# EAGLE design E-P-020-R2.0 (EAGLE 7.3.0)
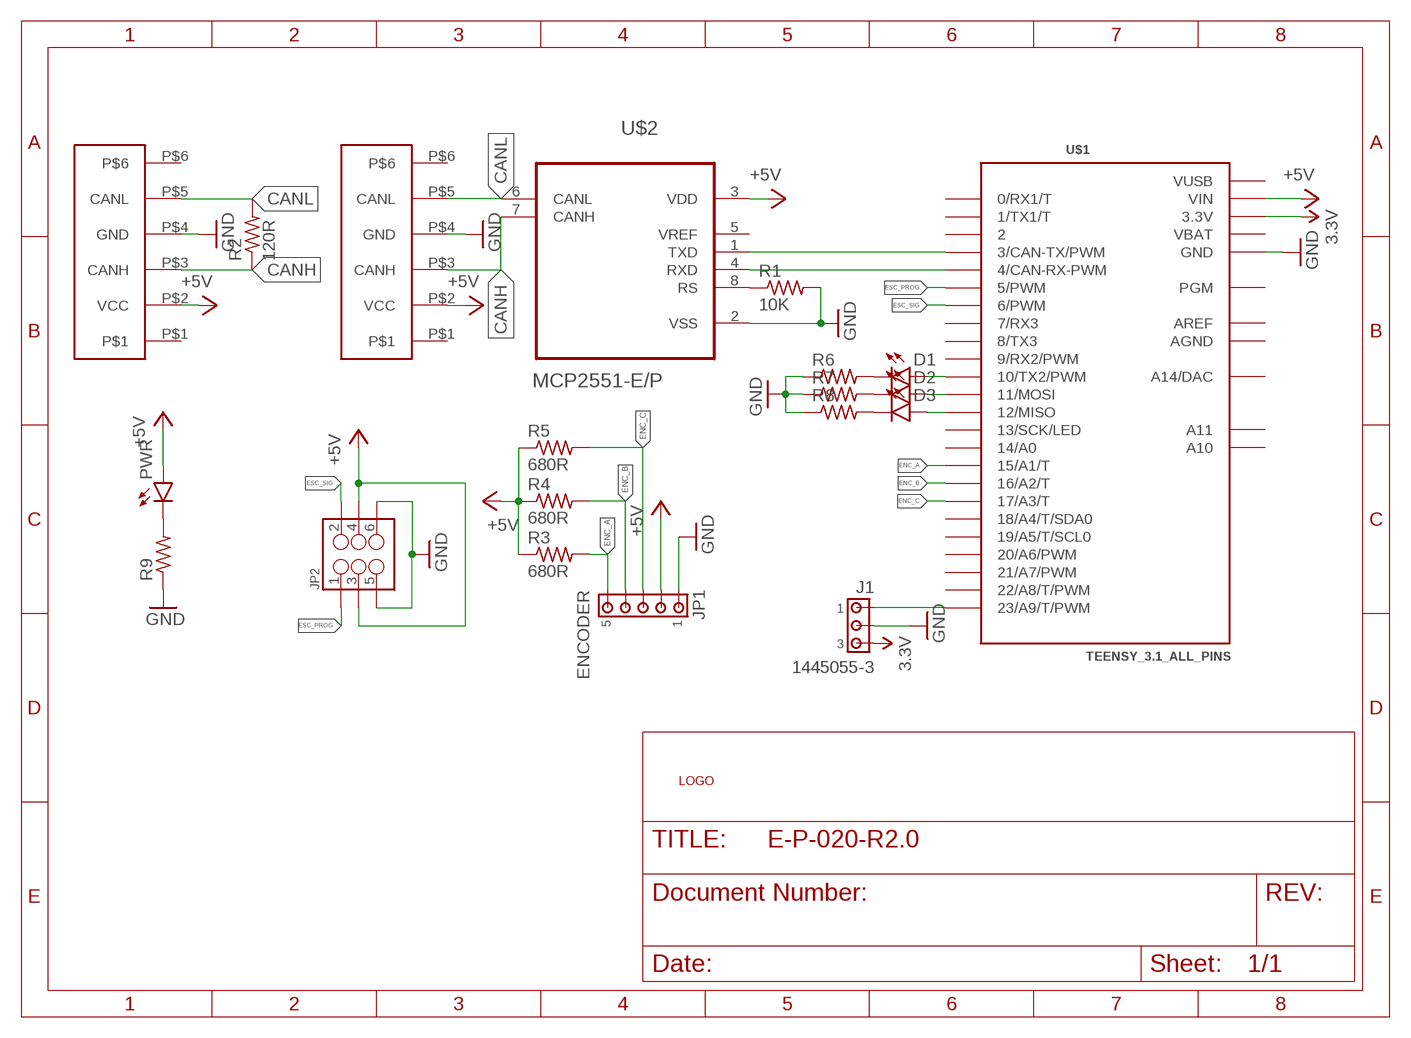
[diagram p0: schematic, sheet 1]

## Parts
D1  BLUE  LED-BLUE1206  [LED-1206]
D2  BLUE  LED-BLUE1206  [LED-1206]
D3  BLUE  LED-BLUE1206  [LED-1206]
J1  1445055-3  [1445055-3]
JP1  ENCODER  1445055-5  [1445055-5]
JP2  M03X2POGO_PINS  [2X3_POGO]
PWR  BLUE  LED-BLUE1206  [LED-1206]
R1  10K  R-US_R0805  [R0805]
R2  120R  R-US_M1206  [M1206]
R3  680R  R-US_M0805  [M0805]
R4  680R  R-US_M0805  [M0805]
R5  680R  R-US_M0805  [M0805]
R6  R-US_M1206  [M1206]
R7  R-US_M1206  [M1206]
R8  R-US_M1206  [M1206]
R9  R-US_M1206  [M1206]
U$1  TEENSY_3.1_ALL_PINS  [TEENSY3-ALL_PINS]
U$2  MCP2551-E/P  [DIP254P762X432-8]
U$3  CAN_6P6C  [CAN_6P6C]
U$4  LOGO  [LOGO]
U$5  CAN_6P6C  [CAN_6P6C]

## Nets
3.3V: J1.3 U$1.3.3V U$1.3.3V1(3.3V)
+5V: JP1.2 JP2.P$3 JP2.P$4 PWR.A R3.1 R4.1 R5.1 U$1.VIN U$2.3(VDD) U$3.P$2(VCC) U$5.P$2(VCC)
CANH: R2.1 U$2.7(CANH) U$3.P$3(CANH) U$5.P$3(CANH)
CANL: R2.2 U$2.6(CANL) U$3.P$5(CANL) U$5.P$5(CANL)
ENC_A: JP1.5 R3.2 U$1.15/A1(15/A1/T)
ENC_B: JP1.4 R4.2 U$1.16/A2(16/A2/T)
ENC_C: JP1.3 R5.2 U$1.17/A3(17/A3/T)
ESC_PROG: JP2.P$1 U$1.5(5/PWM)
ESC_SIG: JP2.P$2 U$1.6(6/PWM)
GND: J1.2 JP1.1 JP2.P$5 JP2.P$6 R1.2 R6.1 R7.1 R8.1 R9.1 U$1.GND U$1.GND1(GND) U$2.2(VSS) U$3.P$4(GND) U$5.P$4(GND)
N$1: U$1.4(4/CAN-RX-PWM) U$2.4(RXD)
N$2: U$1.3(3/CAN-TX/PWM) U$2.1(TXD)
N$3: R1.1 U$2.8(RS)
N$4: J1.1 U$1.23/A9(23/A9/T/PWM)
N$5: D3.C R8.2
N$6: D2.C R7.2
N$7: D1.C R6.2
N$8: D3.A U$1.12(12/MISO)
N$9: D2.A U$1.11(11/MOSI)
N$10: D1.A U$1.10(10/TX2/PWM)
N$11: PWR.C R9.2
Unconnected: U$1.0(0/RX1/T) U$1.1(1/TX1/T) U$1.2 U$1.7(7/RX3) U$1.8(8/TX3) U$1.9(9/RX2/PWM) U$1.13(13/SCK/LED) U$1.14/A0 U$1.18/A4(18/A4/T/SDA0) U$1.19/A5(19/A5/T/SCL0) U$1.20/A6(20/A6/PWM) U$1.21/A7(21/A7/PWM) U$1.22/A8(22/A8/T/PWM) U$1.A10 U$1.A11 U$1.PGM U$1.RESET/DAC(A14/DAC) U$2.5(VREF) U$3.P$1 U$3.P$6 U$5.P$1 U$5.P$6

## Power pins joined to a net without a drawn wire
AGND: U$1.AGND
AREF: U$1.AREF
VBAT: U$1.VBAT
VUSB: U$1.VUSB

## Library data of the parts
D1-D3 PWR = SparkFun-LED:LED-BLUE: Blue LEDs for production use Various blue LEDs stocked by SparkFun production 0603 - DIO-08575 Rebel - DIO-09553 1206 - DIO-09911; PROD_ID: DIO-09911
J1 = con-amp:1445055-3: Micro MATE-N-LOK Connectors grid 1.5 mm Source: ENG_CD_1445055_A.pdf
JP1 = con-amp:1445055-5: Micro MATE-N-LOK Connectors grid 1.5 mm Source: ENG_CD_1445055_A.pdf
JP2 = SparkFun-Connectors:M03X2: 2x3 .1" header. Shrouded, with keying- CONN-10681 SMT- CONN-11415 Pogo pins- HW-11044; PROD_ID: HW-11044
R1-R5 = rcl:R-US_: RESISTOR, American symbol
R6-R9 = resistor:R-US_: RESISTOR, American symbol
U$1 = Teensy_3_and_LC_Series_Boards_v1.1:TEENSY_3.1_ALL_PINS: Footprint for Teensy 3.1 or 3.2 board using all through-holes, i.e. the entire perimeter plus the 4 through-holes inboard (A10,A11,AREF, VUSB)
U$2 = Microchip_By_element14_Batch_1:MCP2551-E/P: High-Speed CAN Transceiver; MPN: MCP2551-E/P; OC_FARNELL: 1439745; OC_NEWARK: 69K7603; PACKAGE: DIP-8; SUPPLIER: Microchip
U$3 U$5 = Shell2015:CAN_6P6C: Digikey part: 553-2258-ND
U$4 = Shell2015:LOGO

## Board
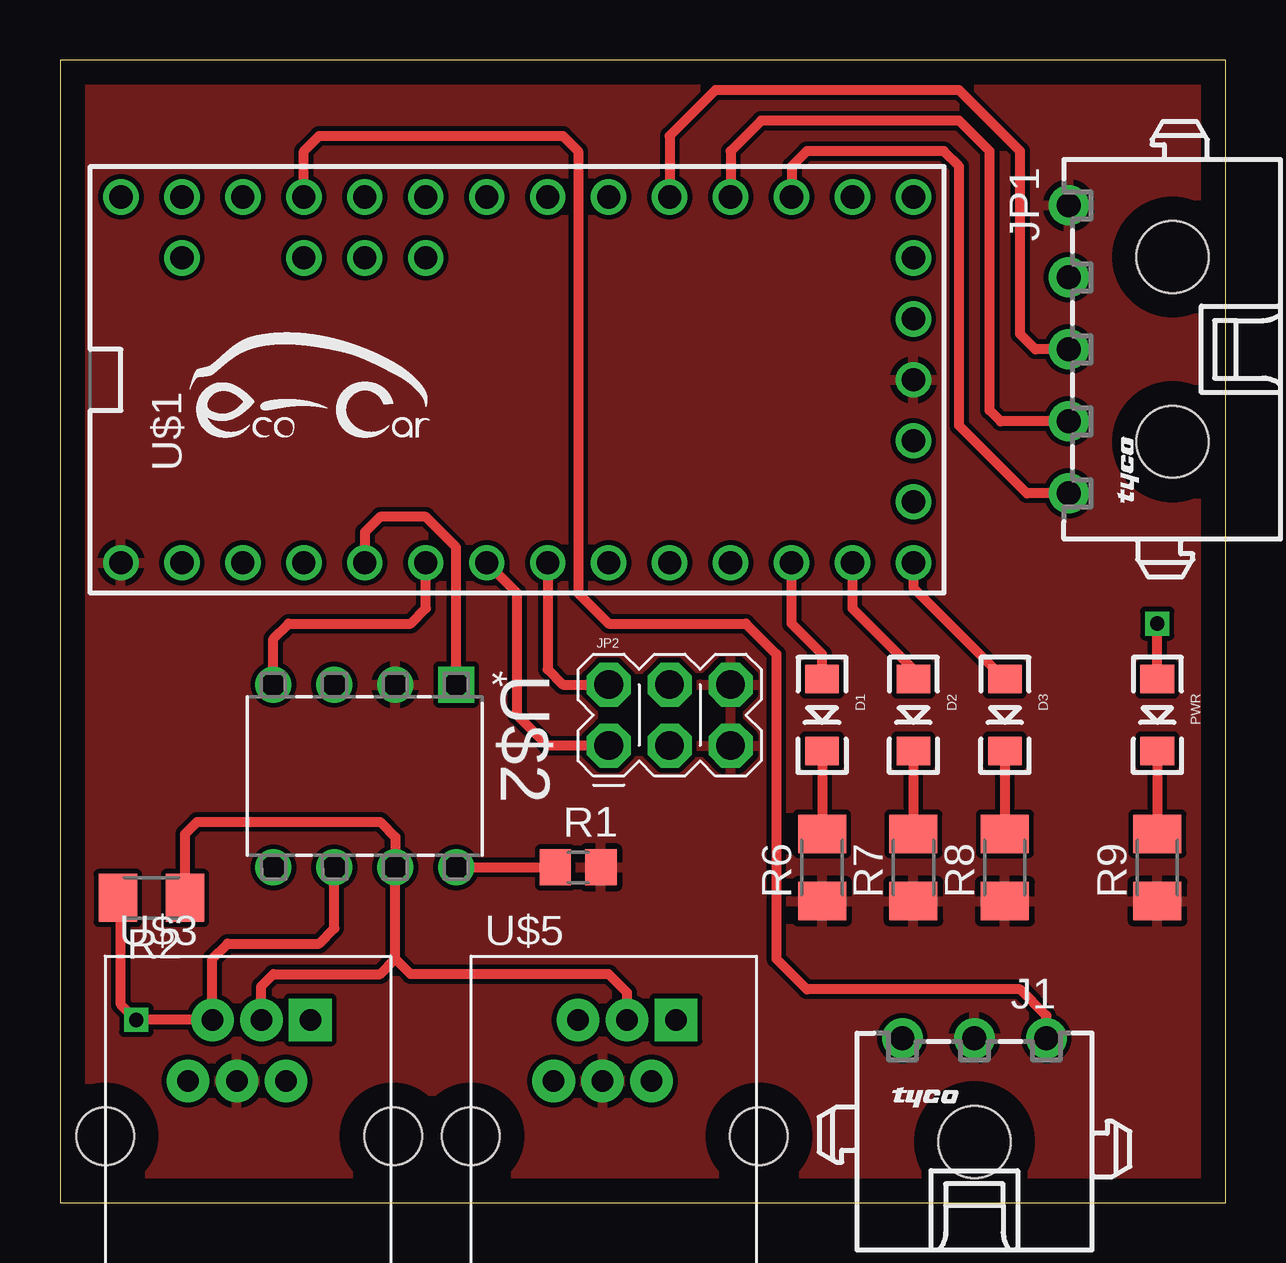
[diagram p1: board, top side]
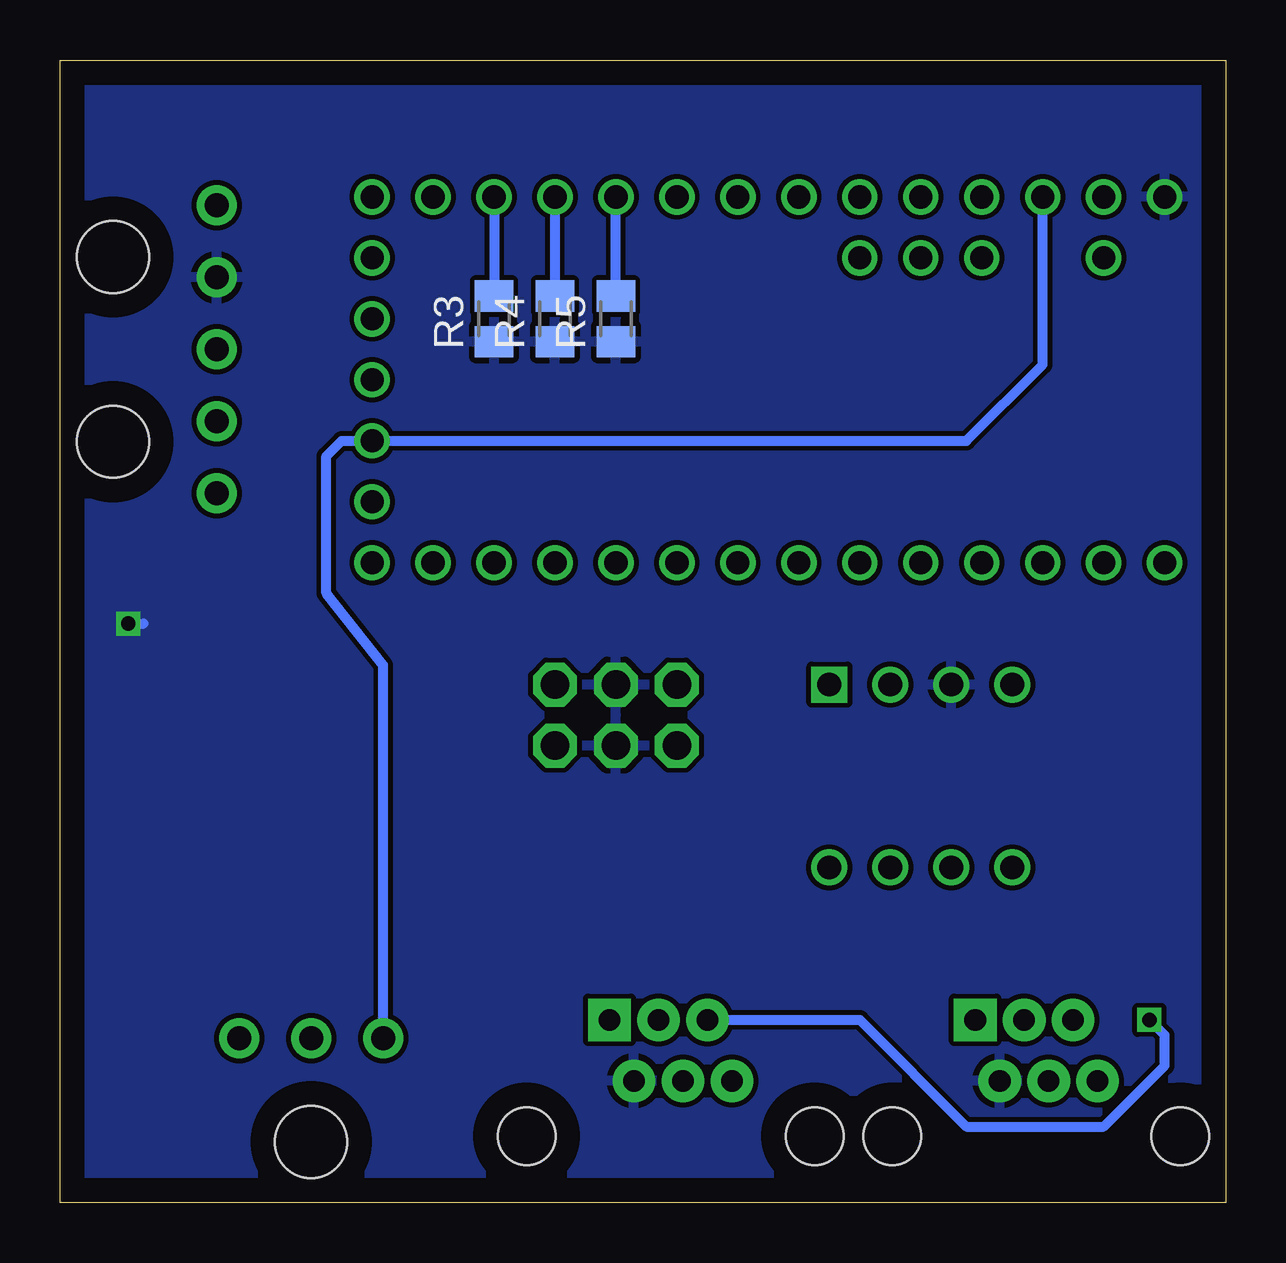
[diagram p2: board, bottom side, seen from below]

Size 48.56 x 47.61 mm. Coordinates in mm from the lower left corner, seen from the top.
Outline: 0,0 48.56,0 48.56,47.61 0,47.61 0,0
Copper layers (1*16): Top 0.203mm / dielectric 1.094mm / Bottom 0.203mm
Design rules "APCircuits": minimum track width 8mil, minimum drill 0.000509375mm, track to track 8mil, track to pad 8mil, pad to pad 8mil, via to via 15mil, smd to smd 8mil, copper to edge 40mil, drill to drill 8mil, minimum pad ring 10mil, minimum via ring 8mil, stop-mask expansion 4mil, vias tented up to drill 0mil, thermal gap 10mil

### Footprints (pad centres in the part's own frame; a part is rotated, then mirrored left to right if it is on the bottom)
LED-1206 = smd 1.2 x 1.4: A -1.5,0; C 1.5,0
1445055-3 = drill 1 pad 1.676: 1 3,4.32; 2 0,4.32; 3 -3,4.32 | hole 3: 0,0
1445055-5 = drill 1 pad 1.676: 1 6,4.32; 2 3,4.32; 3 0,4.32; 4 -3,4.32; 5 -6,4.32 | hole 3: -3.85,0; 3.85,0
2X3_POGO = drill 1.2 pad 1.829 octagon: P$1 0,0; P$2 0,2.54; P$3 2.54,0; P$4 2.54,2.54; P$5 5.08,0; P$6 5.08,2.54
R0805 = smd 1.3 x 1.5: 1 -0.95,0; 2 0.95,0
M1206 = smd 1.6 x 2: 1 -1.4,0; 2 1.4,0
M0805 = smd 1.3 x 1.6: 1 -0.95,0; 2 0.95,0
TEENSY3-ALL_PINS = drill 0.965: 0 -7.62,13.97; 1 -7.62,11.43; 2 -7.62,8.89; 3 -7.62,6.35; 3.3V 7.62,11.43; 3.3V1 -2.54,-16.51; 4 -7.62,3.81; 5 -7.62,1.27; 6 -7.62,-1.27; 7 -7.62,-3.81; 8 -7.62,-6.35; 9 -7.62,-8.89; 10 -7.62,-11.43; 11 -7.62,-13.97; 12 -7.62,-16.51; 13 7.62,-16.51; 14/A0 7.62,-13.97; 15/A1 7.62,-11.43; 16/A2 7.62,-8.89; 17/A3 7.62,-6.35; 18/A4 7.62,-3.81; 19/A5 7.62,-1.27; 20/A6 7.62,1.27; 21/A7 7.62,3.81; 22/A8 7.62,6.35; 23/A9 7.62,8.89; A10 5.08,6.35; A11 5.08,3.81; AGND 7.62,13.97; AREF 5.08,8.89; GND -7.62,16.51; GND1 0,-16.51; PGM 2.54,-16.51; RESET/DAC 5.08,-16.51; VBAT -5.08,-16.51; VIN 7.62,16.51; VUSB 5.08,13.97
DIP254P762X432-8 = drill 0.991 square: 1 -7.62,7.62 | drill 0.991: 2 -7.62,5.08; 3 -7.62,2.54; 4 -7.62,0; 5 0,0; 6 0,2.54; 7 0,5.08; 8 0,7.62
CAN_6P6C = drill 0.9 pad 1.778 square: P$1 4.08,0 | drill 0.9 pad 1.778: P$2 3.06,-2.54; P$3 2.04,0; P$4 1.02,-2.54; P$5 0,0; P$6 -1.02,-2.54 | hole 2.4: -4.47,-4.84; 7.53,-4.84

### Placement (x,y rotation side)
D1  31.75,20.32 270 top
D2  35.56,20.32 270 top
D3  39.37,20.32 270 top
J1  38.1,2.54 0 top
JP1  46.35,35.56 90 top
JP2  22.86,19.05 0 top
PWR  45.72,20.32 270 top
R1  21.59,13.97 0 top
R2  3.81,12.7 180 top
R3  30.48,36.83 90 bottom
R4  27.94,36.83 90 bottom
R5  25.4,36.83 90 bottom
R6  31.75,13.97 90 top
R7  35.56,13.97 90 top
R8  39.37,13.97 90 top
R9  45.72,13.97 90 top
U$1  19.05,34.29 90 top
U$2  8.89,13.97 270 top
U$3  6.35,7.62 0 top
U$4  10.79,33.66 0 top
U$5  21.59,7.62 0 top

### Tracks (layer width: path | path; a pad name or v marks a point on that pad's centre or on a via)
3.3V
  Bottom 0.406: J1.3 35.1,22.4 37.47,25.4 37.47,31.11 36.83,31.75 U$1.3.3V1 10.79,31.75 7.62,34.92 U$1.3.3V
+5V  (via drill 0.6)
  Top 0.406: PWR.A v45.72,24.13
  Bottom 0.406: v45.72,24.13 45.09,24.13
  pour Bottom: 0,0 48.9,0 48.9,47.62 0,47.62
CANH
  Top 0.406: U$3.P$3 8.39,9.03 8.89,9.53 13.34,9.53 13.97,10.16 | 13.97,10.16 U$2.7 13.97,15.24 13.34,15.87 5.71,15.87 5.21,15.37 R2.1 | U$5.P$3 23.63,8.75 22.86,9.53 14.61,9.53 13.97,10.16
CANL  (via drill 0.6)
  Top 0.406: R2.2 2.54,12.57 2.54,8.25 v3.17,7.62 U$3.P$5 6.35,10.16 6.99,10.79 10.79,10.79 11.43,11.43 U$2.6
  Bottom 0.406: U$5.P$5 15.24,7.62 10.79,3.18 5.08,3.18 2.54,5.71 2.54,6.98 v3.17,7.62
ENC_A
  Top 0.406: JP1.5 40.29,29.56 37.47,32.38 37.47,43.18 36.83,43.81 31.11,43.81 30.48,43.18 U$1.15/A1
  Bottom 0.406: U$1.15/A1 R3.2
ENC_B
  Top 0.406: JP1.4 39.2,32.56 38.73,33.02 38.73,43.81 37.47,45.09 29.21,45.09 27.94,43.81 U$1.16/A2
  Bottom 0.406: U$1.16/A2 R4.2
ENC_C
  Top 0.406: JP1.3 40.64,35.56 40.01,36.2 40.01,43.81 37.47,46.35 27.3,46.35 25.4,44.45 U$1.17/A3
  Bottom 0.406: R5.2 U$1.17/A3
ESC_PROG
  Top 0.406: JP2.P$1 20.32,19.05 19.05,20.32 19.05,25.4 U$1.5
ESC_SIG
  Top 0.406: U$1.6 20.32,22.23 20.95,21.59 JP2.P$2
GND
  pour Top: 0,47.62 48.9,47.62 48.9,0 0,0
N$1
  Top 0.406: U$2.4 8.89,23.5 9.53,24.13 14.61,24.13 15.24,24.77 U$1.4
N$2
  Top 0.406: U$2.1 16.51,27.3 15.24,28.57 13.34,28.57 12.7,27.94 U$1.3
N$3
  Top 0.406: U$2.8 R1.1
N$4
  Top 0.406: U$1.23/A9 10.16,43.81 10.79,44.45 20.95,44.45 21.59,43.81 21.59,25.4 22.86,24.13 28.57,24.13 29.84,22.86 29.84,10.16 31.11,8.89 40.01,8.89 41.1,7.79 J1.1
N$5
  Top 0.406: D3.C R8.2
N$6
  Top 0.406: D2.C R7.2
N$7
  Top 0.406: D1.C R6.2
N$8
  Top 0.406: U$1.12 35.56,25.63 D3.A
N$9
  Top 0.406: U$1.11 33.02,24.77 35.56,22.23 D2.A
N$10
  Top 0.406: D1.A 31.75,22.86 30.48,24.13 U$1.10
N$11
  Top 0.406: PWR.C R9.2